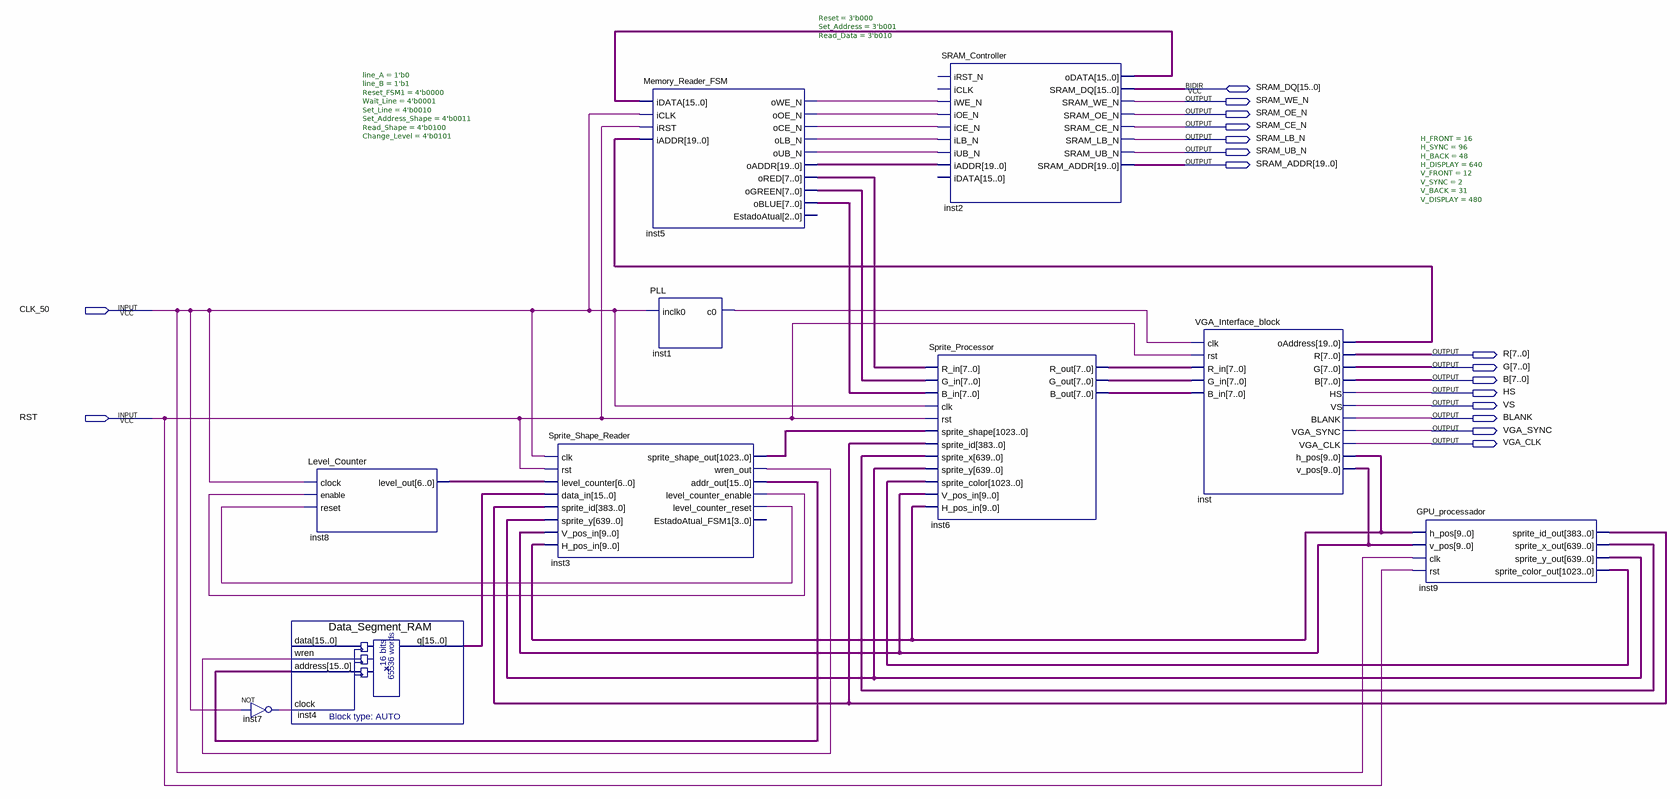
[diagram p0: schematic sheet]
// Quartus schematic LAB-IV.bdf as structural Verilog: 10 symbols, 17 pins
module \LAB-IV  (
  input  CLK_50,
  input  RST,
  inout  [15:0] SRAM_DQ,
  output SRAM_WE_N,
  output SRAM_OE_N,
  output SRAM_CE_N,
  output SRAM_LB_N,
  output SRAM_UB_N,
  output [19:0] SRAM_ADDR,
  output [7:0] R,
  output [7:0] G,
  output [7:0] B,
  output HS,
  output VS,
  output BLANK,
  output VGA_SYNC,
  output VGA_CLK
);

  wire inst1_c0, inst3_level_counter_enable, inst3_level_counter_reset, inst3_wren_out, inst5_oce_n,
       inst5_olb_n, inst5_ooe_n, inst5_oub_n, inst5_owe_n, inst7_out;
  wire [6:0] inst8_level_out;
  wire [7:0] inst5_oblue, inst5_ogreen, inst5_ored, inst6_b_out, inst6_g_out, inst6_r_out;
  wire [9:0] inst_h_pos, inst_v_pos;
  wire [15:0] inst2_odata, inst3_addr_out, inst4_q;
  wire [19:0] inst5_oaddr, inst_oaddress;
  wire [383:0] inst9_sprite_id_out;
  wire [639:0] inst9_sprite_x_out, inst9_sprite_y_out;
  wire [1023:0] inst3_sprite_shape_out, inst9_sprite_color_out;

  not inst7 (inst7_out, CLK_50);
  Data_Segment_RAM inst4 (
    .wren(inst3_wren_out), .address(inst3_addr_out), .clock(inst7_out), .q(inst4_q));  // open: data
  Level_Counter inst8 (
    .clock(CLK_50), .enable(inst3_level_counter_enable), .reset(inst3_level_counter_reset),
    .level_out(inst8_level_out));
  Sprite_Shape_Reader #(.line_A(1'b0), .line_B(1'b1), .Reset_FSM1(4'b0000), .Wait_Line(4'b0001), .Set_Line(4'b0010), .Set_Address_Shape(4'b0011), .Read_Shape(4'b0100), .Change_Level(4'b0101)) inst3 (
    .clk(CLK_50), .rst(RST), .level_counter(inst8_level_out), .data_in(inst4_q),
    .sprite_id(inst9_sprite_id_out), .sprite_y(inst9_sprite_y_out), .V_pos_in(inst_v_pos),
    .H_pos_in(inst_h_pos), .sprite_shape_out(inst3_sprite_shape_out), .wren_out(inst3_wren_out),
    .addr_out(inst3_addr_out), .level_counter_enable(inst3_level_counter_enable),
    .level_counter_reset(inst3_level_counter_reset));  // open: EstadoAtual_FSM1
  Memory_Reader_FSM #(.Reset(3'b000), .Set_Address(3'b001), .Read_Data(3'b010)) inst5 (
    .iDATA(inst2_odata), .iCLK(CLK_50), .iRST(RST), .iADDR(inst_oaddress), .oWE_N(inst5_owe_n),
    .oOE_N(inst5_ooe_n), .oCE_N(inst5_oce_n), .oLB_N(inst5_olb_n), .oUB_N(inst5_oub_n), .oADDR(inst5_oaddr),
    .oRED(inst5_ored), .oGREEN(inst5_ogreen), .oBLUE(inst5_oblue));  // open: EstadoAtual
  PLL inst1 (.inclk0(CLK_50), .c0(inst1_c0));
  SRAM_Controller inst2 (
    .iWE_N(inst5_owe_n), .iOE_N(inst5_ooe_n), .iCE_N(inst5_oce_n), .iLB_N(inst5_olb_n), .iUB_N(inst5_oub_n),
    .iADDR(inst5_oaddr), .oDATA(inst2_odata), .SRAM_WE_N(SRAM_WE_N), .SRAM_OE_N(SRAM_OE_N),
    .SRAM_CE_N(SRAM_CE_N), .SRAM_LB_N(SRAM_LB_N), .SRAM_UB_N(SRAM_UB_N), .SRAM_ADDR(SRAM_ADDR),
    .SRAM_DQ(SRAM_DQ));  // open: iRST_N, iCLK, iDATA
  Sprite_Processor inst6 (
    .R_in(inst5_ored), .G_in(inst5_ogreen), .B_in(inst5_oblue), .clk(CLK_50), .rst(RST),
    .sprite_shape(inst3_sprite_shape_out), .sprite_id(inst9_sprite_id_out), .sprite_x(inst9_sprite_x_out),
    .sprite_y(inst9_sprite_y_out), .sprite_color(inst9_sprite_color_out), .V_pos_in(inst_v_pos),
    .H_pos_in(inst_h_pos), .R_out(inst6_r_out), .G_out(inst6_g_out), .B_out(inst6_b_out));
  VGA_Interface_block #(.H_FRONT(16), .H_SYNC(96), .H_BACK(48), .H_DISPLAY(640), .V_FRONT(12), .V_SYNC(2), .V_BACK(31), .V_DISPLAY(480)) inst (
    .clk(inst1_c0), .rst(RST), .R_in(inst6_r_out), .G_in(inst6_g_out), .B_in(inst6_b_out),
    .oAddress(inst_oaddress), .R(R), .G(G), .B(B), .HS(HS), .VS(VS), .BLANK(BLANK), .VGA_SYNC(VGA_SYNC),
    .VGA_CLK(VGA_CLK), .h_pos(inst_h_pos), .v_pos(inst_v_pos));
  GPU_processador inst9 (
    .h_pos(inst_h_pos), .v_pos(inst_v_pos), .clk(CLK_50), .rst(RST), .sprite_id_out(inst9_sprite_id_out),
    .sprite_x_out(inst9_sprite_x_out), .sprite_y_out(inst9_sprite_y_out),
    .sprite_color_out(inst9_sprite_color_out));
endmodule
